# Altium schematic sheet 07 RAM_PWR.SchDoc
size 420 x 297 mm; Address1: Address1; Address2: Address2; Address3: Address3; Address4: Address4; DocumentNumber: АБВГ.123456.001 Э3; SheetNumber: 7; SheetTotal: 23; Scale: 1:1; DocumentType: Схема электрическая принципиальная; FirstReferrence: АБВГ.123456.001
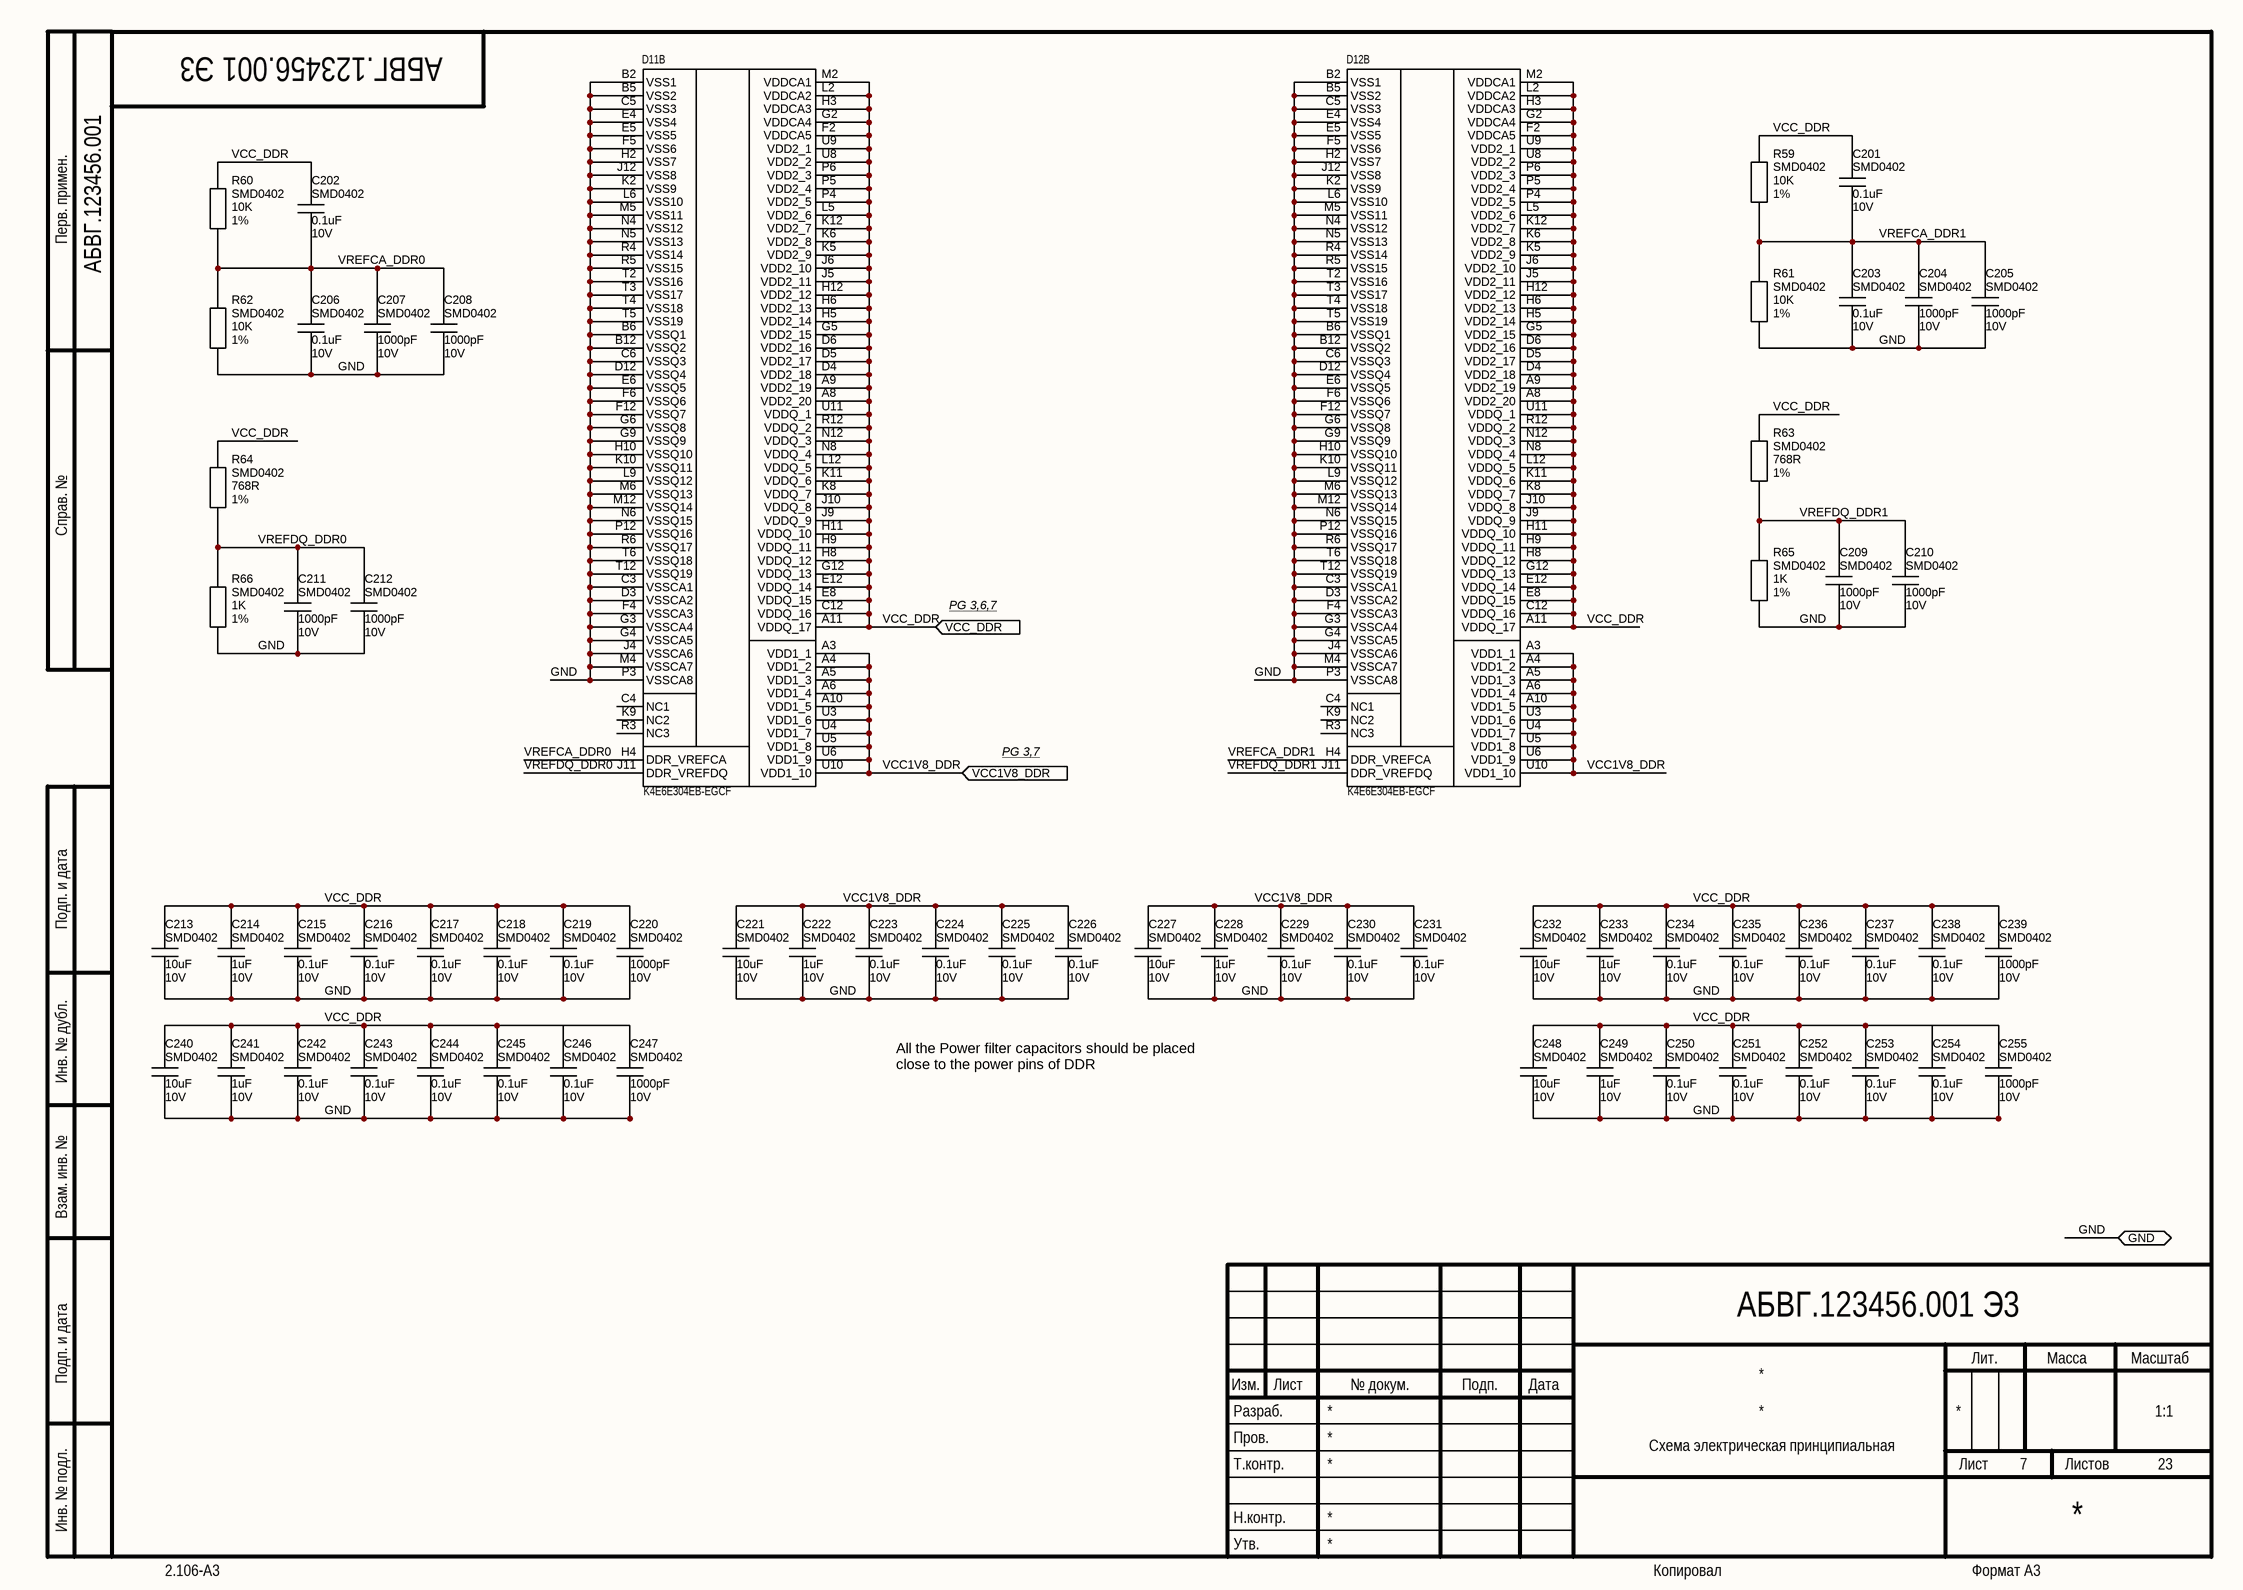
[diagram p0: 07 RAM_PWR.SchDoc]

## Parts
C201  Package: SMD0402  Voltage: 10V  [CAP_SMD_0402_small]  (hidden comment: 0.1uF)
C202  Package: SMD0402  Voltage: 10V  [CAP_SMD_0402_small]  (hidden comment: 0.1uF)
C203  Package: SMD0402  Voltage: 10V  [CAP_SMD_0402_small]  (hidden comment: 0.1uF)
C204  Package: SMD0402  Voltage: 10V  [CAP_SMD_0402_small]  (hidden comment: 1000pF)
C205  Package: SMD0402  Voltage: 10V  [CAP_SMD_0402_small]  (hidden comment: 1000pF)
C206  Package: SMD0402  Voltage: 10V  [CAP_SMD_0402_small]  (hidden comment: 0.1uF)
C207  Package: SMD0402  Voltage: 10V  [CAP_SMD_0402_small]  (hidden comment: 1000pF)
C208  Package: SMD0402  Voltage: 10V  [CAP_SMD_0402_small]  (hidden comment: 1000pF)
C209  Package: SMD0402  Voltage: 10V  [CAP_SMD_0402_small]  (hidden comment: 1000pF)
C210  Package: SMD0402  Voltage: 10V  [CAP_SMD_0402_small]  (hidden comment: 1000pF)
C211  Package: SMD0402  Voltage: 10V  [CAP_SMD_0402_small]  (hidden comment: 1000pF)
C212  Package: SMD0402  Voltage: 10V  [CAP_SMD_0402_small]  (hidden comment: 1000pF)
C213  Package: SMD0402  Voltage: 10V  [CAP_SMD_0402_small]  (hidden comment: 10uF)
C214  Package: SMD0402  Voltage: 10V  [CAP_SMD_0402_small]  (hidden comment: 1uF)
C215  Package: SMD0402  Voltage: 10V  [CAP_SMD_0402_small]  (hidden comment: 0.1uF)
C216  Package: SMD0402  Voltage: 10V  [CAP_SMD_0402_small]  (hidden comment: 0.1uF)
C217  Package: SMD0402  Voltage: 10V  [CAP_SMD_0402_small]  (hidden comment: 0.1uF)
C218  Package: SMD0402  Voltage: 10V  [CAP_SMD_0402_small]  (hidden comment: 0.1uF)
C219  Package: SMD0402  Voltage: 10V  [CAP_SMD_0402_small]  (hidden comment: 0.1uF)
C220  Package: SMD0402  Voltage: 10V  [CAP_SMD_0402_small]  (hidden comment: 1000pF)
C221  Package: SMD0402  Voltage: 10V  [CAP_SMD_0402_small]  (hidden comment: 10uF)
C222  Package: SMD0402  Voltage: 10V  [CAP_SMD_0402_small]  (hidden comment: 1uF)
C223  Package: SMD0402  Voltage: 10V  [CAP_SMD_0402_small]  (hidden comment: 0.1uF)
C224  Package: SMD0402  Voltage: 10V  [CAP_SMD_0402_small]  (hidden comment: 0.1uF)
C225  Package: SMD0402  Voltage: 10V  [CAP_SMD_0402_small]  (hidden comment: 0.1uF)
C226  Package: SMD0402  Voltage: 10V  [CAP_SMD_0402_small]  (hidden comment: 0.1uF)
C227  Package: SMD0402  Voltage: 10V  [CAP_SMD_0402_small]  (hidden comment: 10uF)
C228  Package: SMD0402  Voltage: 10V  [CAP_SMD_0402_small]  (hidden comment: 1uF)
C229  Package: SMD0402  Voltage: 10V  [CAP_SMD_0402_small]  (hidden comment: 0.1uF)
C230  Package: SMD0402  Voltage: 10V  [CAP_SMD_0402_small]  (hidden comment: 0.1uF)
C231  Package: SMD0402  Voltage: 10V  [CAP_SMD_0402_small]  (hidden comment: 0.1uF)
C232  Package: SMD0402  Voltage: 10V  [CAP_SMD_0402_small]  (hidden comment: 10uF)
C233  Package: SMD0402  Voltage: 10V  [CAP_SMD_0402_small]  (hidden comment: 1uF)
C234  Package: SMD0402  Voltage: 10V  [CAP_SMD_0402_small]  (hidden comment: 0.1uF)
C235  Package: SMD0402  Voltage: 10V  [CAP_SMD_0402_small]  (hidden comment: 0.1uF)
C236  Package: SMD0402  Voltage: 10V  [CAP_SMD_0402_small]  (hidden comment: 0.1uF)
C237  Package: SMD0402  Voltage: 10V  [CAP_SMD_0402_small]  (hidden comment: 0.1uF)
C238  Package: SMD0402  Voltage: 10V  [CAP_SMD_0402_small]  (hidden comment: 0.1uF)
C239  Package: SMD0402  Voltage: 10V  [CAP_SMD_0402_small]  (hidden comment: 1000pF)
C240  Package: SMD0402  Voltage: 10V  [CAP_SMD_0402_small]  (hidden comment: 10uF)
C241  Package: SMD0402  Voltage: 10V  [CAP_SMD_0402_small]  (hidden comment: 1uF)
C242  Package: SMD0402  Voltage: 10V  [CAP_SMD_0402_small]  (hidden comment: 0.1uF)
C243  Package: SMD0402  Voltage: 10V  [CAP_SMD_0402_small]  (hidden comment: 0.1uF)
C244  Package: SMD0402  Voltage: 10V  [CAP_SMD_0402_small]  (hidden comment: 0.1uF)
C245  Package: SMD0402  Voltage: 10V  [CAP_SMD_0402_small]  (hidden comment: 0.1uF)
C246  Package: SMD0402  Voltage: 10V  [CAP_SMD_0402_small]  (hidden comment: 0.1uF)
C247  Package: SMD0402  Voltage: 10V  [CAP_SMD_0402_small]  (hidden comment: 1000pF)
C248  Package: SMD0402  Voltage: 10V  [CAP_SMD_0402_small]  (hidden comment: 10uF)
C249  Package: SMD0402  Voltage: 10V  [CAP_SMD_0402_small]  (hidden comment: 1uF)
C250  Package: SMD0402  Voltage: 10V  [CAP_SMD_0402_small]  (hidden comment: 0.1uF)
C251  Package: SMD0402  Voltage: 10V  [CAP_SMD_0402_small]  (hidden comment: 0.1uF)
C252  Package: SMD0402  Voltage: 10V  [CAP_SMD_0402_small]  (hidden comment: 0.1uF)
C253  Package: SMD0402  Voltage: 10V  [CAP_SMD_0402_small]  (hidden comment: 0.1uF)
C254  Package: SMD0402  Voltage: 10V  [CAP_SMD_0402_small]  (hidden comment: 0.1uF)
C255  Package: SMD0402  Voltage: 10V  [CAP_SMD_0402_small]  (hidden comment: 1000pF)
D11  K4E6E304EB-EGCF  [FBGA178_13R00X11R50X1R20]  (part B of 2)
D12  K4E6E304EB-EGCF  [FBGA178_13R00X11R50X1R20]  (part B of 2)
R59  Package: SMD0402  Tolerance: 1%  [RES_SMD_0402_SMALL]  (hidden comment: 10K)
R60  Package: SMD0402  Tolerance: 1%  [RES_SMD_0402_SMALL]  (hidden comment: 10K)
R61  Package: SMD0402  Tolerance: 1%  [RES_SMD_0402_SMALL]  (hidden comment: 10K)
R62  Package: SMD0402  Tolerance: 1%  [RES_SMD_0402_SMALL]  (hidden comment: 10K)
R63  Package: SMD0402  Tolerance: 1%  [RES_SMD_0402_SMALL]  (hidden comment: 768R)
R64  Package: SMD0402  Tolerance: 1%  [RES_SMD_0402_SMALL]  (hidden comment: 768R)
R65  Package: SMD0402  Tolerance: 1%  [RES_SMD_0402_SMALL]  (hidden comment: 1K)
R66  Package: SMD0402  Tolerance: 1%  [RES_SMD_0402_SMALL]  (hidden comment: 1K)

## Ports
GND (bidir), VCC1V8_DDR (in), VCC_DDR (in)

## Nets
GND: C203.2 C204.1 C205.1 C206.2 C207.1 C208.1 C209.1 C210.1 C211.1 C212.1 C213.2 C214.2 C215.2 C216.2 C217.2 C218.2 C219.2 C220.1 C221.2 C222.2 C223.2 C224.2 C225.2 C226.2 C227.2 C228.2 C229.2 C230.2 C231.2 C232.2 C233.2 C234.2 C235.2 C236.2 C237.2 C238.2 C239.1 C240.2 C241.2 C242.2 C243.2 C244.2 C245.2 C246.2 C247.1 C248.2 C249.2 C250.2 C251.2 C252.2 C253.2 C254.2 C255.1 D11.B2(VSS1) D11.B5(VSS2) D11.B6(VSSQ1) D11.B12(VSSQ2) D11.C3(VSSCA1) D11.C5(VSS3) D11.C6(VSSQ3) D11.D3(VSSCA2) D11.D12(VSSQ4) D11.E4(VSS4) D11.E5(VSS5) D11.E6(VSSQ5) D11.F4(VSSCA3) D11.F5(VSS6) D11.F6(VSSQ6) D11.F12(VSSQ7) D11.G3(VSSCA4) D11.G4(VSSCA5) D11.G6(VSSQ8) D11.G9(VSSQ9) D11.H2(VSS7) D11.H10(VSSQ10) D11.J4(VSSCA6) D11.J12(VSS8) D11.K2(VSS9) D11.K10(VSSQ11) D11.L6(VSS10) D11.L9(VSSQ12) D11.M4(VSSCA7) D11.M5(VSS11) D11.M6(VSSQ13) D11.M12(VSSQ14) D11.N4(VSS12) D11.N5(VSS13) D11.N6(VSSQ15) D11.P3(VSSCA8) D11.P12(VSSQ16) D11.R4(VSS14) D11.R5(VSS15) D11.R6(VSSQ17) D11.T2(VSS16) D11.T3(VSS17) D11.T4(VSS18) D11.T5(VSS19) D11.T6(VSSQ18) D11.T12(VSSQ19) D12.B2(VSS1) D12.B5(VSS2) D12.B6(VSSQ1) D12.B12(VSSQ2) D12.C3(VSSCA1) D12.C5(VSS3) D12.C6(VSSQ3) D12.D3(VSSCA2) D12.D12(VSSQ4) D12.E4(VSS4) D12.E5(VSS5) D12.E6(VSSQ5) D12.F4(VSSCA3) D12.F5(VSS6) D12.F6(VSSQ6) D12.F12(VSSQ7) D12.G3(VSSCA4) D12.G4(VSSCA5) D12.G6(VSSQ8) D12.G9(VSSQ9) D12.H2(VSS7) D12.H10(VSSQ10) D12.J4(VSSCA6) D12.J12(VSS8) D12.K2(VSS9) D12.K10(VSSQ11) D12.L6(VSS10) D12.L9(VSSQ12) D12.M4(VSSCA7) D12.M5(VSS11) D12.M6(VSSQ13) D12.M12(VSSQ14) D12.N4(VSS12) D12.N5(VSS13) D12.N6(VSSQ15) D12.P3(VSSCA8) D12.P12(VSSQ16) D12.R4(VSS14) D12.R5(VSS15) D12.R6(VSSQ17) D12.T2(VSS16) D12.T3(VSS17) D12.T4(VSS18) D12.T5(VSS19) D12.T6(VSSQ18) D12.T12(VSSQ19) R61.1 R62.1 R65.1 R66.1 ; port GND
VCC1V8_DDR: C221.1 C222.1 C223.1 C224.1 C225.1 C226.1 C227.1 C228.1 C229.1 C230.1 C231.1 D11.A3(VDD1_1) D11.A4(VDD1_2) D11.A5(VDD1_3) D11.A6(VDD1_4) D11.A10(VDD1_5) D11.U3(VDD1_6) D11.U4(VDD1_7) D11.U5(VDD1_8) D11.U6(VDD1_9) D11.U10(VDD1_10) D12.A3(VDD1_1) D12.A4(VDD1_2) D12.A5(VDD1_3) D12.A6(VDD1_4) D12.A10(VDD1_5) D12.U3(VDD1_6) D12.U4(VDD1_7) D12.U5(VDD1_8) D12.U6(VDD1_9) D12.U10(VDD1_10) ; port VCC1V8_DDR
VCC_DDR: C201.1 C202.1 C213.1 C214.1 C215.1 C216.1 C217.1 C218.1 C219.1 C220.2 C232.1 C233.1 C234.1 C235.1 C236.1 C237.1 C238.1 C239.2 C240.1 C241.1 C242.1 C243.1 C244.1 C245.1 C246.1 C247.2 C248.1 C249.1 C250.1 C251.1 C252.1 C253.1 C254.1 C255.2 D11.A8(VDD2_20) D11.A9(VDD2_19) D11.A11(VDDQ_17) D11.C12(VDDQ_16) D11.D4(VDD2_18) D11.D5(VDD2_17) D11.D6(VDD2_16) D11.E8(VDDQ_15) D11.E12(VDDQ_14) D11.F2(VDDCA5) D11.G2(VDDCA4) D11.G5(VDD2_15) D11.G12(VDDQ_13) D11.H3(VDDCA3) D11.H5(VDD2_14) D11.H6(VDD2_13) D11.H8(VDDQ_12) D11.H9(VDDQ_11) D11.H11(VDDQ_10) D11.H12(VDD2_12) D11.J5(VDD2_11) D11.J6(VDD2_10) D11.J9(VDDQ_9) D11.J10(VDDQ_8) D11.K5(VDD2_9) D11.K6(VDD2_8) D11.K8(VDDQ_7) D11.K11(VDDQ_6) D11.K12(VDD2_7) D11.L2(VDDCA2) D11.L5(VDD2_6) D11.L12(VDDQ_5) D11.M2(VDDCA1) D11.N8(VDDQ_4) D11.N12(VDDQ_3) D11.P4(VDD2_5) D11.P5(VDD2_4) D11.P6(VDD2_3) D11.R12(VDDQ_2) D11.U8(VDD2_2) D11.U9(VDD2_1) D11.U11(VDDQ_1) D12.A8(VDD2_20) D12.A9(VDD2_19) D12.A11(VDDQ_17) D12.C12(VDDQ_16) D12.D4(VDD2_18) D12.D5(VDD2_17) D12.D6(VDD2_16) D12.E8(VDDQ_15) D12.E12(VDDQ_14) D12.F2(VDDCA5) D12.G2(VDDCA4) D12.G5(VDD2_15) D12.G12(VDDQ_13) D12.H3(VDDCA3) D12.H5(VDD2_14) D12.H6(VDD2_13) D12.H8(VDDQ_12) D12.H9(VDDQ_11) D12.H11(VDDQ_10) D12.H12(VDD2_12) D12.J5(VDD2_11) D12.J6(VDD2_10) D12.J9(VDDQ_9) D12.J10(VDDQ_8) D12.K5(VDD2_9) D12.K6(VDD2_8) D12.K8(VDDQ_7) D12.K11(VDDQ_6) D12.K12(VDD2_7) D12.L2(VDDCA2) D12.L5(VDD2_6) D12.L12(VDDQ_5) D12.M2(VDDCA1) D12.N8(VDDQ_4) D12.N12(VDDQ_3) D12.P4(VDD2_5) D12.P5(VDD2_4) D12.P6(VDD2_3) D12.R12(VDDQ_2) D12.U8(VDD2_2) D12.U9(VDD2_1) D12.U11(VDDQ_1) R59.2 R60.2 R63.2 R64.2 ; port VCC_DDR
VREFCA_DDR0: C202.2 C206.1 C207.2 C208.2 D11.H4(DDR_VREFCA) R60.1 R62.2
VREFCA_DDR1: C201.2 C203.1 C204.2 C205.2 D12.H4(DDR_VREFCA) R59.1 R61.2
VREFDQ_DDR0: C211.2 C212.2 D11.J11(DDR_VREFDQ) R64.1 R66.2
VREFDQ_DDR1: C209.2 C210.2 D12.J11(DDR_VREFDQ) R63.1 R65.2

Not connected (* = marked no-connect by the designer): D11 C4(NC1) K9(NC2) R3(NC3); D12 C4(NC1) K9(NC2) R3(NC3)

## Notes on the sheet
- Перв. примен.
- Справ. №
- PG 3,6,7
- PG 3,7
- Подп. и дата
- Инв. № дубл.
- All the Power filter capacitors should be placed
  close to the power pins of DDR
- Взам. инв. №
- Разраб.
- Изм.
- Лист
- № докум.
- Подп.
- Дата
- Лит.
- Масса
- Масштаб
- Пров.
- Т.контр.
- Листов
- Инв. № подл.
- Утв.
- Н.контр.
- 2.106-A3
- Копировал
- Формат А3

## Library data of the parts
C201-C203 C206 C215-C219 C223-C226 C229-C231 C234-C238 C242-C246 C250-C254 = Ceramic_Cap: PartNumber: CC0402KRX5R6BB104; ComponentType: SMD Ceramic Chip Capacitor; Manufacter: *; Tolerance: *; ClassName: Solder_Clearence; Value: 0.1uF
C204 C205 C207-C212 C220 C239 C247 C255 = Ceramic_Cap: PartNumber: CC0402KRX7R9BB102; ComponentType: SMD Ceramic Chip Capacitor; Manufacter: *; Tolerance: *; ClassName: Solder_Clearence; Value: 1000pF
C213 C221 C227 C232 C240 C248 = Ceramic_Cap: PartNumber: CC0402MRX5R6BB106; ComponentType: SMD Ceramic Chip Capacitor; Manufacter: *; Tolerance: *; ClassName: Solder_Clearence; Value: 10uF
C214 C222 C228 C233 C241 C249 = Ceramic_Cap: PartNumber: CC0402KRX5R6BB105; ComponentType: SMD Ceramic Chip Capacitor; Manufacter: *; Tolerance: *; ClassName: Solder_Clearence; Value: 1uF
D11 D12 = K4E8E304EE-EGCE: ComponentType: *; Manufacter: *; Package: FBGA178; PartNumber: K4E6E304EB-EGCF; ClassName: *; Value: K4E6E304EB-EGCF
R59-R62 = Chip_Res: PartNumber: RC0402FR-0710KL; ComponentType: SMD Chip Resistor; Manufacter: *; Voltage: *; ClassName: Solder_Clearence; Value: 10K
R63 R64 = Chip_Res: PartNumber: RC0402FR-07768RL; ComponentType: SMD Chip Resistor; Manufacter: *; Voltage: *; ClassName: Solder_Clearence; Value: 768R
R65 R66 = Chip_Res: PartNumber: RC0402FR-071KL; ComponentType: SMD Chip Resistor; Manufacter: *; Voltage: *; ClassName: Solder_Clearence; Value: 1K